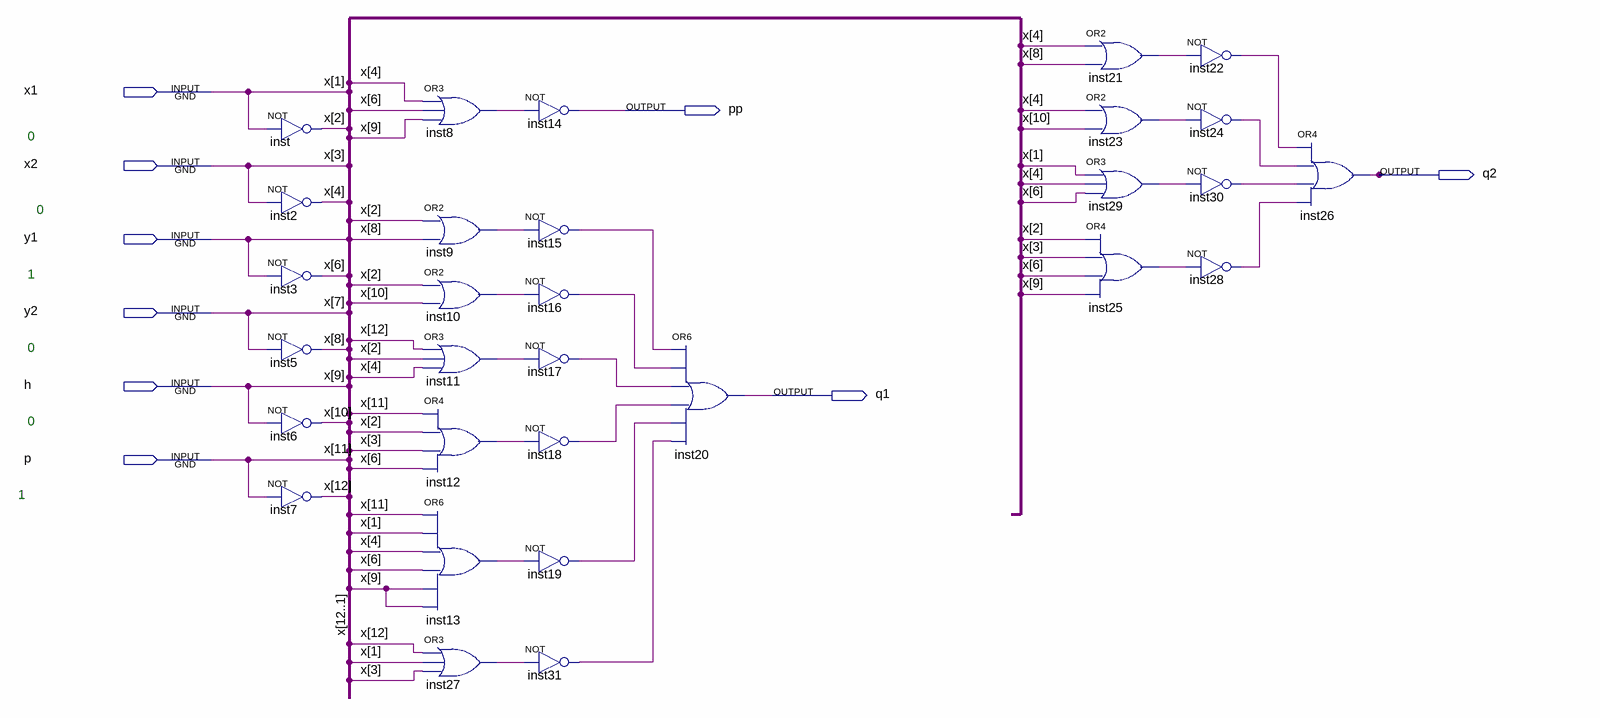
[diagram p0: schematic sheet]
// Quartus schematic ochus1.bdf as structural Verilog: 30 symbols, 9 pins
module ochus1 (
  input  x1,
  input  x2,
  input  y1,
  input  y2,
  input  h,
  input  p,
  output pp,
  output q2,
  output q1
);

  wire inst8_out, inst9_out, inst10_out, inst11_out, inst12_out, inst13_out, inst15_out, inst16_out,
       inst17_out, inst18_out, inst19_out, inst21_out, inst22_out, inst23_out, inst24_out, inst25_out,
       inst27_out, inst28_out, inst29_out, inst30_out, inst31_out;
  wire [12:4] x;

  not inst (x2, x1);
  not inst2 (x[4], x2);
  not inst3 (x[6], y1);
  not inst5 (x[8], y2);
  not inst6 (x[10], h);
  not inst7 (x[12], p);
  or inst8 (inst8_out, x[4], x[6], h);
  or inst9 (inst9_out, x2, x[8]);
  or inst10 (inst10_out, x2, x[10]);
  or inst11 (inst11_out, x[12], x2, x[4]);
  or inst12 (inst12_out, p, x2, x2, x[6]);
  or inst13 (inst13_out, p, x1, x[4], x[6], h, h);
  or inst27 (inst27_out, x[12], x1, x2);
  not inst14 (pp, inst8_out);
  not inst15 (inst15_out, inst9_out);
  not inst16 (inst16_out, inst10_out);
  not inst17 (inst17_out, inst11_out);
  not inst18 (inst18_out, inst12_out);
  not inst19 (inst19_out, inst13_out);
  not inst31 (inst31_out, inst27_out);
  or inst20 (q1, inst15_out, inst16_out, inst17_out, inst18_out, inst19_out, inst31_out);
  or inst21 (inst21_out, x[4], x[8]);
  or inst23 (inst23_out, x[4], x[10]);
  or inst29 (inst29_out, x1, x[4], x[6]);
  or inst25 (inst25_out, x2, x2, x[6], h);
  not inst22 (inst22_out, inst21_out);
  not inst24 (inst24_out, inst23_out);
  not inst30 (inst30_out, inst29_out);
  not inst28 (inst28_out, inst25_out);
  or inst26 (q2, inst22_out, inst24_out, inst30_out, inst28_out);

  // Other names for the same wires on the sheet: x (some bits) = {p, h, y2, x2}

  // Notes on the sheet:
  //   0
  //   0
  //   1
  //   0
  //   0
  //   1
endmodule
